# EAGLE design AT42QT1010_Capacitive_Touch_Breakout (EAGLE 6.0)
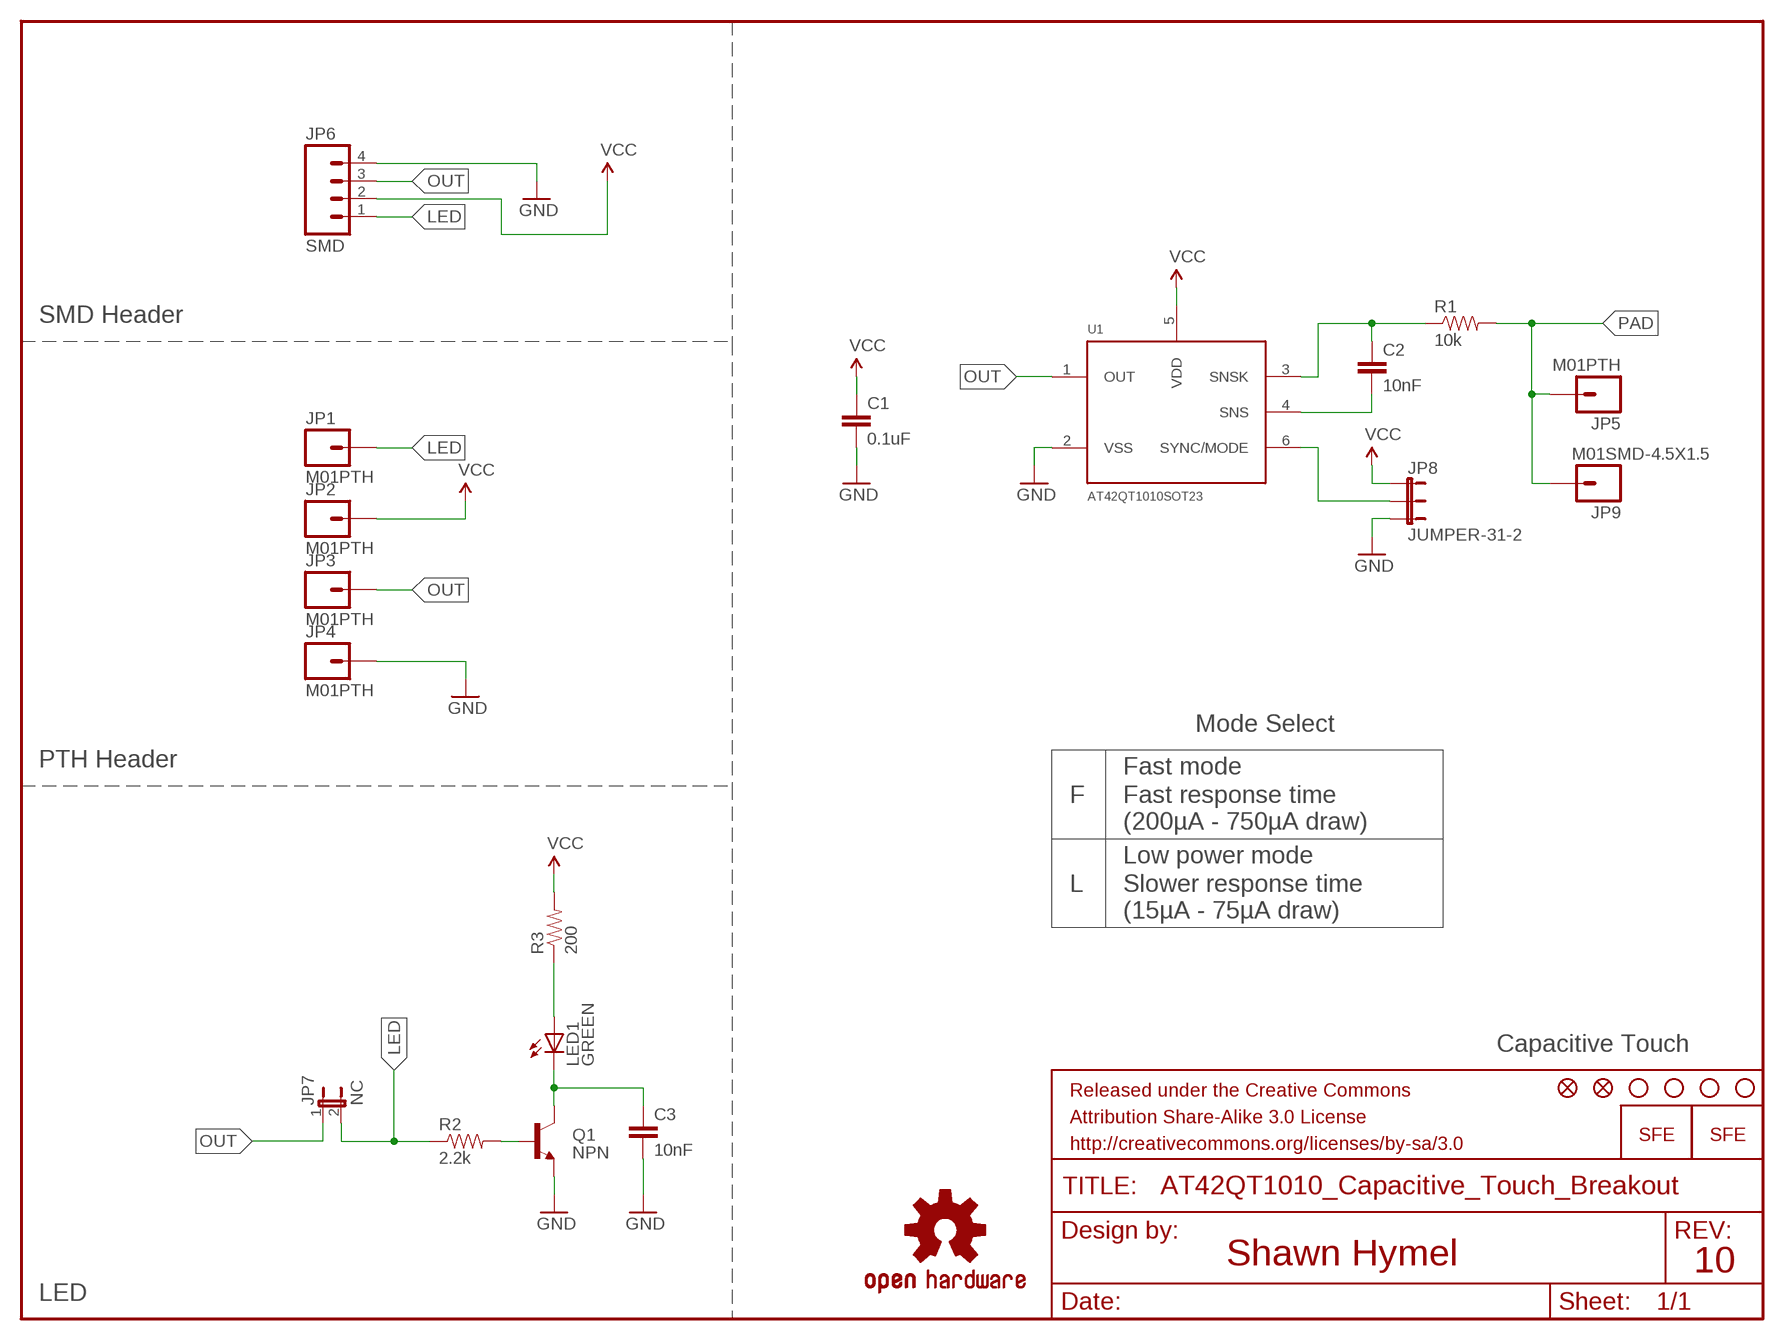
[diagram p0: schematic, sheet 1]

## Parts
C1  0.1uF  CAP0603-CAP  [0603-CAP]
C2  10nF  CAP0603-CAP  [0603-CAP]
C3  10nF  CAP0603-CAP  [0603-CAP]
FID1  FIDUCIAL1X2  [FIDUCIAL-1X2]
FID2  FIDUCIAL1X2  [FIDUCIAL-1X2]
FRAME1  FRAME-LETTER  [CREATIVE_COMMONS]
JP1  M01PTH  [1X01]
JP2  M01PTH  [1X01]
JP3  M01PTH  [1X01]
JP4  M01PTH  [1X01]
JP5  M01PTH  [1X01]
JP6  SMD  M04SMD_LONG  [1X04-SMD_LONG]
JP7  NC  JUMPER-2SMD-NC  [SJ_2S]
JP8  JUMPER-31-2  [SJ_3_PASTE1&2]
JP9  M01SMD-4.5X1.5  [PAD-1.5X4.5]
LED1  GREEN  LED1206-BOTTOM  [LED-1206-BOTTOM]
LOGO1  LOGO-SFENEW  [SFE-NEW-WEBLOGO]
LOGO2  OSHW-LOGOS  [OSHW-LOGO-S]
LOGO3  LOGO-SFESK  [SFE-LOGO-FLAME]
Q1  NPN  TRANSISTOR_NPNMMBT2222A  [SOT23]
R1  10k  RESISTOR0603  [0603-RES]
R2  2.2k  RESISTOR0603  [0603-RES]
R3  200  RESISTOR0603  [0603-RES]
STANDOFF1  STAND-OFF  [STAND-OFF]
STANDOFF2  STAND-OFF  [STAND-OFF]
STANDOFF3  STAND-OFF  [STAND-OFF]
STANDOFF4  STAND-OFF  [STAND-OFF]
U1  AT42QT1010SOT23  [SOT23-6]

## Nets
GND: C1.2 C3.2 JP4.1 JP6.4 JP8.3 Q1.2(E) U1.2(VSS)
LED: JP1.1 JP6.1 JP7.2 R2.1
N$4: C2.2 U1.4(SNS)
N$5: C2.1 R1.1 U1.3(SNSK)
N$7: JP8.2 U1.6(SYNC/MODE)
N$10: Q1.1(B) R2.2
N$11: C3.1 LED1.C Q1.3(C)
N$12: LED1.A R3.1
OUT: JP3.1 JP6.3 JP7.1 U1.1(OUT)
PAD: JP5.1 JP9.P$1 R1.2
VCC: C1.1 JP2.1 JP6.2 JP8.1 R3.2 U1.5(VDD)

## Notes on the sheet
- SMD Header
- Mode Select
- PTH Header | Fast mode
- F | Fast response time
- (200µA - 750µA draw)
- Low power mode
- L | Slower response time
- (15µA - 75µA draw)
- Capacitive Touch
- Shawn Hymel | 10
- LED

## Library data of the parts
C1-C3 = SparkFun-Capacitors:CAP: Capacitor Standard 0603 ceramic capacitor, and 0.1" leaded capacitor.
FID1 FID2 = SparkFun-Aesthetics:FIDUCIAL: Fiducial Alignment Points Various fiducial points for machine vision alignment.
FRAME1 = SparkFun-Aesthetics:FRAME-LETTER: Schematic Frame Standard 8.5x11 US Letter frame
JP1-JP5 JP9 = SparkFun-Connectors:M01: Header 1 Standard 1-pin 0.1" header. Use with straight break away headers (SKU : PRT-00116), right angle break away headers (PRT-00553), swiss pins (PRT-00743), machine pins (PRT-00117), and female headers (PRT-00115).
JP6 = SparkFun-Connectors:M04: Header 4 Standard 4-pin 0.1" header. Use with straight break away headers (SKU : PRT-00116), right angle break away headers (PRT-00553), swiss pins (PRT-00743), machine pins (PRT-00117), and female headers (PRT-00115). Molex polarized connector foot print use with SKU : PRT-08231 with associated crimp pins and housings. 1MM SMD Version SKU: PRT-10208
JP7 = SparkFun-Passives:JUMPER-2: Jumper Basic 0.1" spaced jumper. Use with breakaway headers.
JP8 = SparkFun-Passives:JUMPER-3
LED1 = SparkFun-LED:LED: LEDs Standard schematic elements and footprints for 5mm, 3mm, 1206, and 0603 sized LEDs. 5mm - Spark Fun Electronics SKU : COM-00529 (and others)
LOGO1 LOGO3 = SparkFun-Aesthetics:LOGO-SFE: Spark Fun Electronics PCB Logo This is the standard Spark Fun Electronics PCB logo.
LOGO2 = SparkFun-Aesthetics:OSHW-LOGO: Open Source Hardware Logo This logo indicates the piece of hardware it is found on incorporates a OSHW license and/or adheres to the definition of open source hardware found here: http://freedomdefined.org/OSHW
Q1 = SparkFun-DiscreteSemi:TRANSISTOR_NPN: Generic NPN BJT MMBT2222A - TRANS-08049 (SOT-23, 1A 40V) MPSA42 - TRANS-09116 (SOT-23, 500mA 300V) MMBT5088LT1G - TRANS-11160 (SOT-23, 50 mA 30V); PROD_ID: TRANS-08049; VALUE: MMBT2222A
R1-R3 = SparkFun-Resistors:RESISTOR: Resistor Basic schematic elements and footprints for 0603, 1206, and PTH resistors.
STANDOFF1-STANDOFF4 = SparkFun-Electromechanical:STAND-OFF: #4 Stand Off This is the mechanical footprint for a #4 phillips button head screw. Use the keepout ring to avoid running the screw head into surrounding components. SKU : PRT-00447
U1 = SparkFun-DigitalIC:AT42QT1010

## Net classes
0 default: clearance 0.205 mm

## Board
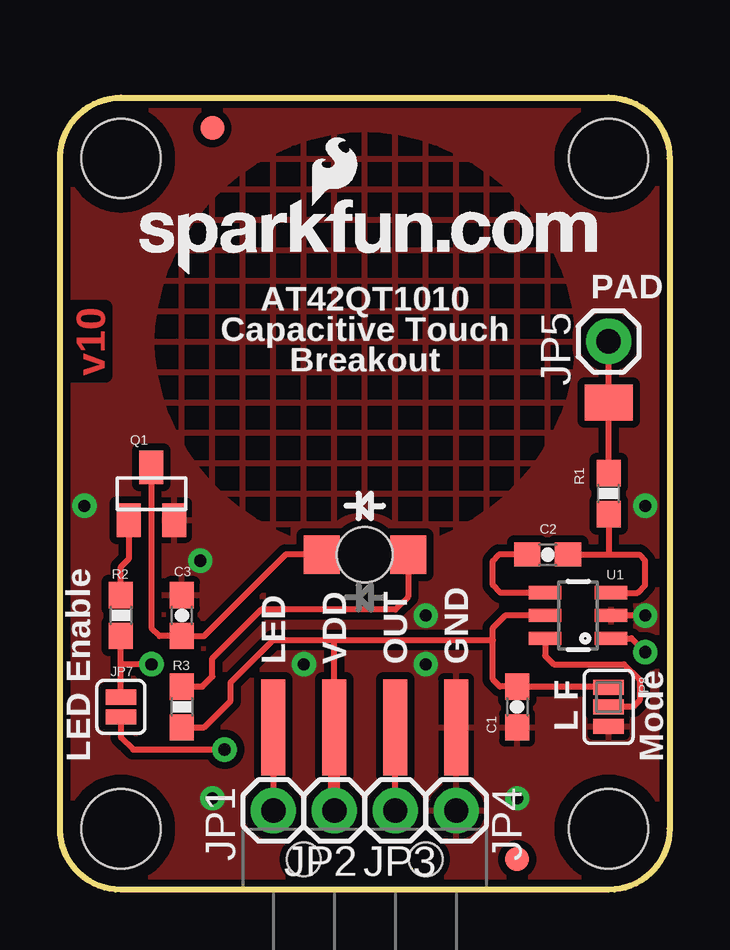
[diagram p1: board, top side]
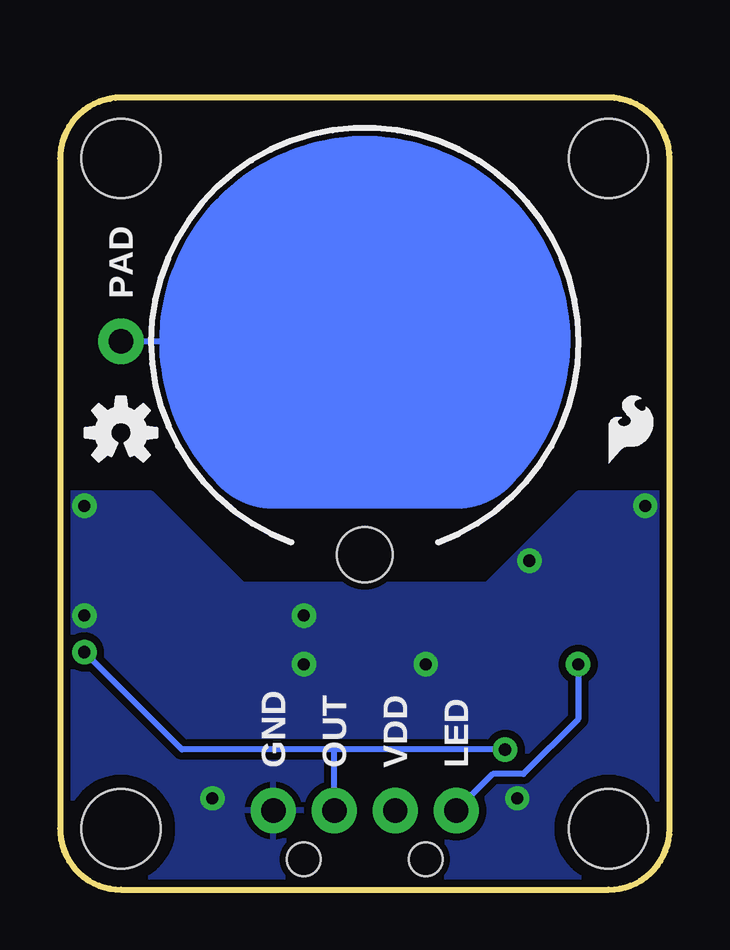
[diagram p2: board, bottom side, seen from below]

Size 25.4 x 33.02 mm. Coordinates in mm from the lower left corner, seen from the top.
Outline: 0,2.54 0,30.48 arc-90 2.54,33.02 22.86,33.02 arc-90 25.4,30.48 25.4,2.54 arc-90 22.86,0 2.54,0 arc-90 0,2.54
Copper layers (1*16): Top 0.035mm / dielectric 1.5mm / Bottom 0.035mm
Design rules: minimum track width 7mil, minimum drill 15mil, track to track 8mil, track to pad 8mil, pad to pad 8mil, via to via 8mil, smd to smd 8mil, copper to edge 8mil, drill to drill 8mil, minimum pad ring 12mil, minimum via ring 10mil, stop-mask expansion 4mil, vias tented up to drill 20mil, thermal gap 10mil
tRestrict: area 0,0 to 2.5,2.5; area 22.9,0 to 25.4,2.5; area 0,30.5 to 2.5,33; area 22.9,30.5 to 25.4,33; area 18.5,12.7 to 19.3,13.2; area 20.1,13 to 20.6,13.2; area 21.1,9.7 to 22.1,13.2; area 22.1,13 to 23.9,13.5; area 3,13.2 to 3.3,13.5; area 3.3,10.2 to 3.8,10.4; area 4.8,9.4 to 5.8,9.7; area 3.6,6.3 to 4.3,8.4; area 5.8,7.6 to 6.1,7.9; area 6.1,7.9 to 6.3,8.1; area 6.3,8.1 to 6.6,8.4; area 8.9,12.2 to 14,12.7; area 9.4,12.7 to 9.9,13.5; area 19.3,9.4 to 19.8,9.9; area 15,2.3 to 15.5,2.8; area 9.9,2.3 to 10.4,2.8; area 11.2,0.5 to 14.2,2; area 12.4,2.3 to 13,2.8; area 19.8,8.9 to 20.3,9.4; area 18.5,9.4 to 19.3,10.9

### Footprints (pad centres in the part's own frame; a part is rotated, then mirrored left to right if it is on the bottom)
0603-CAP = smd 1.1 x 1: 1 -0.85,0; 2 0.85,0
FIDUCIAL-1X2 = smd 1 x 1: 1 0,0
1X01 = drill 1.016 pad 1.88: 1 0,0
1X04-SMD_LONG = smd 1 x 4: 1 -3.81,5.5; 2 -1.27,5.5; 3 1.27,5.5; 4 3.81,5.5 | hole 1.4: -2.54,0; 2.54,0
SJ_2S = smd 0.635 x 1.27: 1 -0.412,0; 2 0.412,0
SJ_3_PASTE1&2 = smd 0.635 x 1.27: 1 -0.813,0; 2 0,0; 3 0.813,0
PAD-1.5X4.5 = smd 1.5 x 2: P$1 0,0
LED-1206-BOTTOM = smd 1.5 x 1.6: A -1.8,0; C 1.8,0 | hole 2.3: 0,0
SOT23 = smd 1 x 1.4: 1 -0.95,-1.1; 2 0.95,-1.1; 3 0,1.1
0603-RES = smd 1.1 x 1: 1 -0.85,0; 2 0.85,0
STAND-OFF = hole 3.302: 0,0
SOT23-6 = smd 0.55 x 1.35: 1 -0.95,-1.375; 2 0,-1.375; 3 0.95,-1.375; 4 0.95,1.375; 5 0,1.375; 6 -0.95,1.375

### Placement (x,y rotation side)
C1  19.05,7.62 270 top
C2  20.32,13.97 180 top
C3  5.08,11.43 90 top
FID1  6.35,31.75 0 top
FID2  19.05,1.27 0 top
FRAME1  -15.24,-17.78 0 top  (outside the outline)
JP1  8.89,3.3 0 top
JP2  11.43,3.3 0 top
JP3  13.97,3.3 0 top
JP4  16.51,3.3 0 top
JP5  22.86,22.86 0 top
JP6  12.7,1.27 0 top
JP7  2.54,7.62 90 top
JP8  22.86,7.62 270 top
JP9  22.86,20.32 90 top
LED1  12.7,13.97 180 top
LOGO1  3.3,25.65 0 top
LOGO2  22.86,19.05 0 bottom
LOGO3  2.54,17.78 0 bottom
Q1  3.81,16.51 0 top
R1  22.86,16.51 90 top
R2  2.54,11.43 90 top
R3  5.08,7.62 270 top
STANDOFF1  22.86,2.54 0 top
STANDOFF2  2.54,2.54 0 top
STANDOFF3  22.86,30.48 0 top
STANDOFF4  2.54,30.48 0 top
U1  21.59,11.43 90 top

### Tracks (layer width: path | path; a pad name or v marks a point on that pad's centre or on a via)
GND  (via drill 0.51)
  Top 0.254: v24.38,11.43 U1.2
  other vias: 6.35,3.81 19.05,3.81 5.84,13.72 10.16,9.4 15.24,9.4 1.02,16 24.38,16 15.24,11.43
  pour Bottom (isolate 0.305): 0,0 0,16.51 3.81,16.51 7.62,12.7 17.78,12.7 21.59,16.51 25.4,16.51 25.4,0
  pour Top (isolate 0.305): 0,0 25.4,0 25.4,22.86 21.59,22.86 arc-90 12.7,13.97 arc-90 3.81,22.86 0,22.86
  pour Top (isolate 0.305, hatched): 3.81,22.86 arc-90 12.7,31.75 arc-90 21.59,22.86 arc-90 12.7,13.97 arc-90
  pour Top (isolate 0.305): 3.81,22.86 arc-90 12.7,31.75 arc-90 21.59,22.86 25.4,22.86 25.4,33.02 0,33.02 0,22.86
LED  (via drill 0.51)
  Top 0.254: JP7.2 2.54,9.4 | 2.54,9.4 R2.1 | v3.81,9.4 2.54,9.4 | JP6.1 JP1.1
  Bottom 0.254: v3.81,9.4 3.81,7.11 6.1,4.83 7.37,4.83 JP1.1
N$4
  Top 0.254: U1.4 18.35,12.38 18.03,12.7 18.03,13.72 18.29,13.97 C2.2
N$5
  Top 0.254: C2.1 22.86,13.97 | 22.86,13.97 24.13,13.97 24.38,13.72 24.38,12.7 24.06,12.38 U1.3 | R1.1 22.86,13.97
N$7
  Top 0.254: U1.6 20.21,9.76 20.57,9.4 23.5,9.4 24.16,8.74 24.16,7.9 23.88,7.62 JP8.2
N$10
  Top 0.254: R2.2 2.54,13.46 2.86,13.78 Q1.1
N$11
  Top 0.254: Q1.3 3.81,10.92 4.15,10.58 C3.1 6.01,10.58 9.4,13.97 LED1.C
N$12
  Top 0.254: R3.1 5.93,8.47 6.35,8.89 6.35,9.65 8.38,11.68 13.97,11.68 14.5,12.21 LED1.A
OUT  (via drill 0.51)
  Top 0.254: JP7.1 2.54,6.35 3.05,5.84 v6.86,5.84 | U1.1 23.81,10.48 v24.38,9.91 | JP3.1 JP6.3
  Bottom 0.254: v24.38,9.91 20.32,5.84 13.97,5.84 | JP3.1 13.97,5.84 | v6.86,5.84 13.97,5.84
PAD
  Top 0.254: JP5.1 JP9.P$1 R1.2
  Bottom 0.254: 12.7,22.86 16.51,19.05 19.05,19.05 19.05,17.53 18.8,17.27 18.54,17.27 | 8.89,22.86 8.89,19.05 | 12.78,22.86 12.65,22.99 | 12.95,22.86 JP5.1
  Bottom 6.35: 12.7,22.86 12.78,22.86 12.95,22.86 16.51,22.86 | 8.89,19.05 arc-270 16.51,19.05 8.89,19.05
VCC
  Top 0.254: JP8.1 22.82,8.47 C1.1 18.33,8.47 18.03,8.76 18.03,10.41 | R3.2 6.01,6.77 7.11,7.87 7.11,8.64 8.89,10.41 11.43,10.41 | U1.5 18.54,11.43 18.03,10.92 18.03,10.41 | 11.43,10.41 18.03,10.41 | JP6.2 11.43,10.41
  Top 0.508: JP2.1 JP6.2

### Text on the board
Top: v10
tPlace: PAD | AT42QT1010 | Capacitive Touch | Breakout | Enable | LED | VDD | OUT | GND | F | L | LED | Mode | The 0.09055118 in. (2.3mm) hole is NPTH hole
bPlace: PAD | LED | VDD | OUT | GND
tDocu: Knock out | Shawn Hymel